# Altium project Lidar_MCU_3.PrjPcb
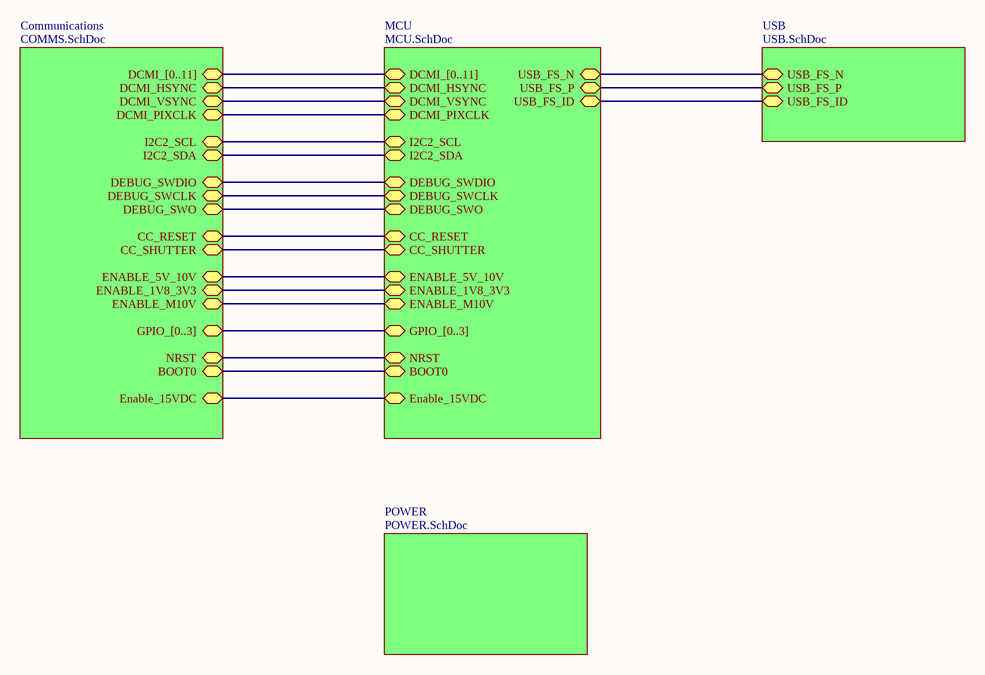
[diagram p0: Top_Level_MCU.SchDoc]
5 sheets, 41 parts. Net scope: hierarchical (ports join the sheet entries above them; power ports are global).
Board file: Lidar_MCU_PCB_3.PcbDoc
Sheets:
  Top_Level_MCU.SchDoc
    MCU = MCU.SchDoc
    USB = USB.SchDoc
    Communications = COMMS.SchDoc
    POWER = POWER.SchDoc

## Sheet Top_Level_MCU.SchDoc
size A; SheetNumber: 1; SheetTotal: 5

### Sub-sheets
Communications = COMMS.SchDoc: DCMI_[0..11] (bidir), DCMI_HSYNC (bidir), DCMI_VSYNC (bidir), DCMI_PIXCLK (bidir), I2C2_SCL (bidir), I2C2_SDA (bidir), DEBUG_SWDIO (bidir), DEBUG_SWCLK (bidir), DEBUG_SWO (bidir), CC_RESET (bidir), CC_SHUTTER (bidir), ENABLE_5V_10V (bidir), ENABLE_1V8_3V3 (bidir), ENABLE_M10V (bidir), GPIO_[0..3] (bidir), NRST (bidir), BOOT0 (bidir), Enable_15VDC (bidir)
MCU = MCU.SchDoc: USB_FS_N (bidir), USB_FS_P (bidir), USB_FS_ID (bidir), DCMI_[0..11] (bidir), DCMI_HSYNC (bidir), DCMI_VSYNC (bidir), DCMI_PIXCLK (bidir), I2C2_SCL (bidir), I2C2_SDA (bidir), DEBUG_SWDIO (bidir), DEBUG_SWCLK (bidir), DEBUG_SWO (bidir), CC_RESET (bidir), CC_SHUTTER (bidir), ENABLE_5V_10V (bidir), ENABLE_1V8_3V3 (bidir), ENABLE_M10V (bidir), GPIO_[0..3] (bidir), NRST (bidir), BOOT0 (bidir), Enable_15VDC (bidir)
POWER = POWER.SchDoc: no entries
USB = USB.SchDoc: USB_FS_N (bidir), USB_FS_P (bidir), USB_FS_ID (bidir)

### Nets
BOOT0: sheet MCU/BOOT0, sheet Communications/BOOT0
CC_RESET: sheet MCU/CC_RESET, sheet Communications/CC_RESET
CC_SHUTTER: sheet MCU/CC_SHUTTER, sheet Communications/CC_SHUTTER
DCMI_HSYNC: sheet MCU/DCMI_HSYNC, sheet Communications/DCMI_HSYNC
DCMI_PIXCLK: sheet MCU/DCMI_PIXCLK, sheet Communications/DCMI_PIXCLK
DCMI_VSYNC: sheet MCU/DCMI_VSYNC, sheet Communications/DCMI_VSYNC
DEBUG_SWCLK: sheet MCU/DEBUG_SWCLK, sheet Communications/DEBUG_SWCLK
DEBUG_SWDIO: sheet MCU/DEBUG_SWDIO, sheet Communications/DEBUG_SWDIO
DEBUG_SWO: sheet MCU/DEBUG_SWO, sheet Communications/DEBUG_SWO
ENABLE_1V8_3V3: sheet MCU/ENABLE_1V8_3V3, sheet Communications/ENABLE_1V8_3V3
ENABLE_5V_10V: sheet MCU/ENABLE_5V_10V, sheet Communications/ENABLE_5V_10V
Enable_15VDC: sheet MCU/Enable_15VDC, sheet Communications/Enable_15VDC
ENABLE_M10V: sheet MCU/ENABLE_M10V, sheet Communications/ENABLE_M10V
I2C2_SCL: sheet MCU/I2C2_SCL, sheet Communications/I2C2_SCL
I2C2_SDA: sheet MCU/I2C2_SDA, sheet Communications/I2C2_SDA
NRST: sheet MCU/NRST, sheet Communications/NRST
USB_FS_ID: sheet MCU/USB_FS_ID, sheet USB/USB_FS_ID
USB_FS_N: sheet MCU/USB_FS_N, sheet USB/USB_FS_N
USB_FS_P: sheet MCU/USB_FS_P, sheet USB/USB_FS_P

### Buses and harness runs
bus sheet Communications/DCMI_[0..11] = sheet MCU/DCMI_[0..11]
bus sheet Communications/GPIO_[0..3] = sheet MCU/GPIO_[0..3]

## Sheet MCU.SchDoc
size A3; SheetNumber: 2; SheetTotal: 5
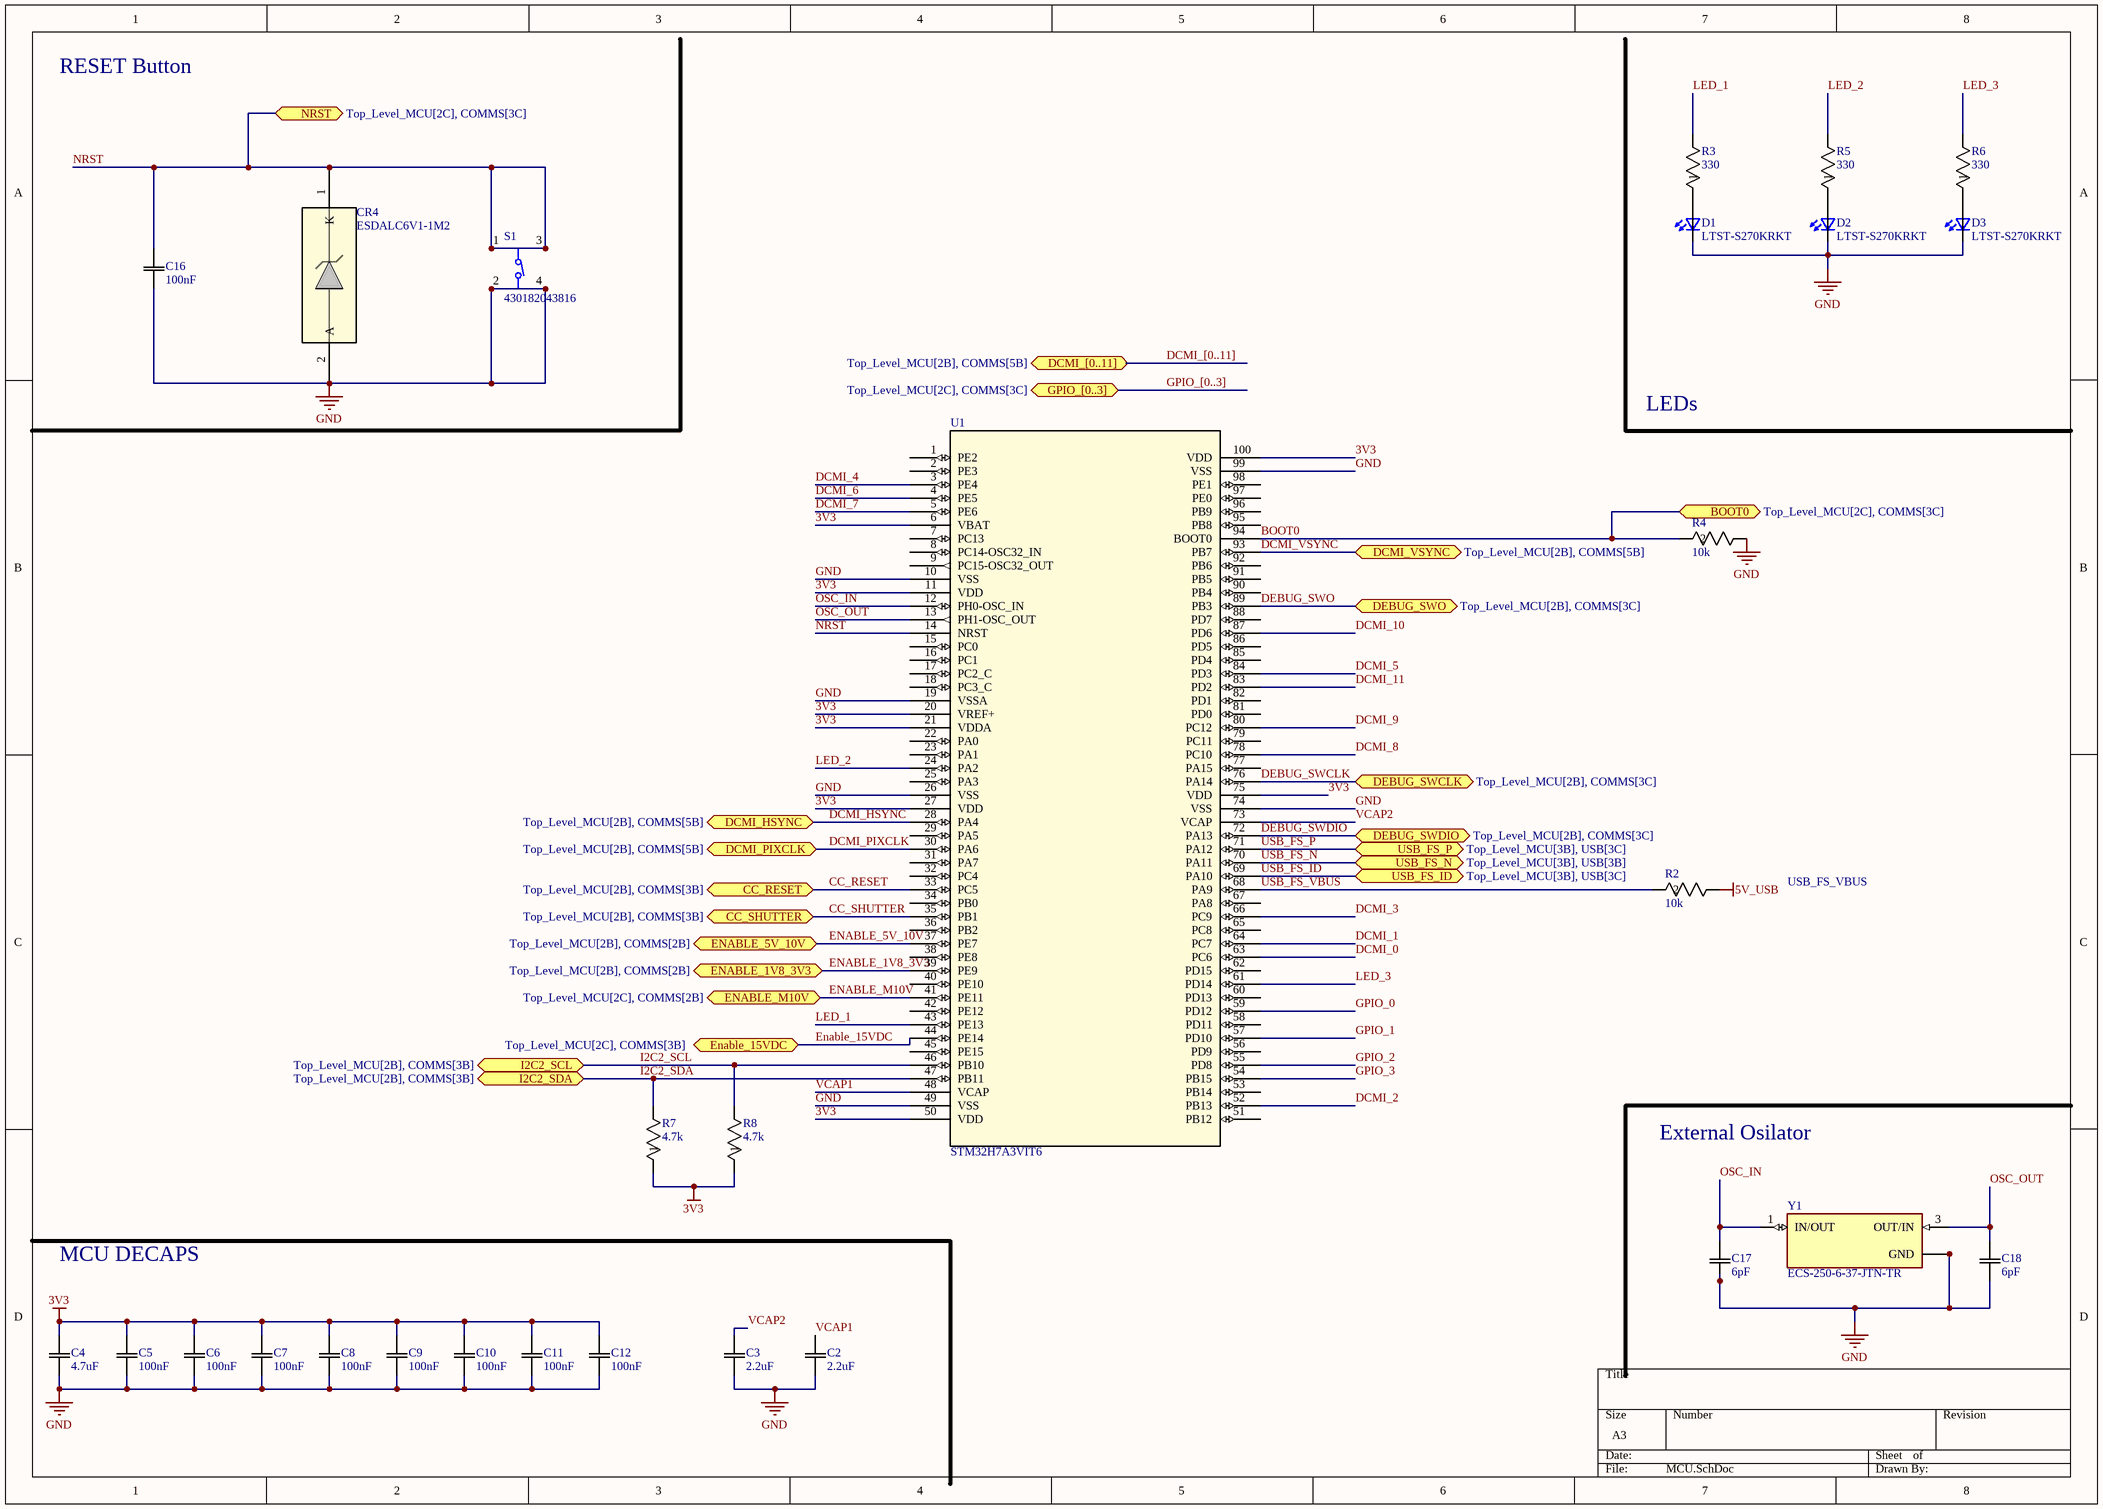
[diagram p1: MCU.SchDoc]

### Parts
C2  2.2uF  [CAP_CL10_SAM]
C3  2.2uF  [CAP_CL10_SAM]
C4  4.7uF  [LMK107_TAY]
C5  100nF  [CAPC10555_55N_KEM]
C6  100nF  [CAPC10555_55N_KEM]
C7  100nF  [CAPC10555_55N_KEM]
C8  100nF  [CAPC10555_55N_KEM]
C9  100nF  [CAPC10555_55N_KEM]
C10  100nF  [CAPC10555_55N_KEM]
C11  100nF  [CAPC10555_55N_KEM]
C12  100nF  [CAPC10555_55N_KEM]
C16  100nF  [CAPC17595_90N_KEM]
C17  6pF  [CAP_06033D104JAT2A]
C18  6pF  [CAP_06033D104JAT2A]
CR4  ESDALC6V1-1M2  [SOD882_STM]
D1  LTST-S270KRKT  [0603]
D2  LTST-S270KRKT  [0603]
D3  LTST-S270KRKT  [0603]
R2  10k  [RC0402N_YAG]
R3  330  [STA_RMCF0603_STP]
R4  10k  [RC0402N_YAG]
R5  330  [STA_RMCF0603_STP]
R6  330  [STA_RMCF0603_STP]
R7  4.7k  [YAG_R0402_YAG]
R8  4.7k  [YAG_R0402_YAG]
S1  430182043816  [430182043816]
U1  STM32H7A3VIT6  [LQFP100]
Y1  ECS-250-6-37-JTN-TR  [XTAL_ECS-250-6-37-JTN-TR]

### Ports
BOOT0 (bidir, see Top_Level_MCU[2C], COMMS[3C]), CC_RESET (bidir, see Top_Level_MCU[2B], COMMS[3B]), CC_SHUTTER (bidir, see Top_Level_MCU[2B], COMMS[3B]), DCMI_[0..11] (bidir, see Top_Level_MCU[2B], COMMS[5B]), DCMI_HSYNC (bidir, see Top_Level_MCU[2B], COMMS[5B]), DCMI_PIXCLK (bidir, see Top_Level_MCU[2B], COMMS[5B]), DCMI_VSYNC (bidir, see Top_Level_MCU[2B], COMMS[5B]), DEBUG_SWCLK (bidir, see Top_Level_MCU[2B], COMMS[3C]), DEBUG_SWDIO (bidir, see Top_Level_MCU[2B], COMMS[3C]), DEBUG_SWO (bidir, see Top_Level_MCU[2B], COMMS[3C]), ENABLE_1V8_3V3 (bidir, see Top_Level_MCU[2B], COMMS[2B]), ENABLE_5V_10V (bidir, see Top_Level_MCU[2B], COMMS[2B]), Enable_15VDC (bidir, see Top_Level_MCU[2C], COMMS[3B]), ENABLE_M10V (bidir, see Top_Level_MCU[2C], COMMS[2B]), GPIO_[0..3] (bidir, see Top_Level_MCU[2C], COMMS[3C]), I2C2_SCL (bidir, see Top_Level_MCU[2B], COMMS[3B]), I2C2_SDA (bidir, see Top_Level_MCU[2B], COMMS[3B]), NRST (bidir, see Top_Level_MCU[2C], COMMS[3C]), USB_FS_ID (bidir, see Top_Level_MCU[3B], USB[3C]), USB_FS_N (bidir, see Top_Level_MCU[3B], USB[3B]), USB_FS_P (bidir, see Top_Level_MCU[3B], USB[3C])

### Nets
3V3: C4.2 C5.2 C6.2 C7.2 C8.2 C9.2 C10.2 C11.2 C12.2 R7.1 R8.1 U1.6(VBAT) U1.11(VDD) U1.20(VREF+) U1.21(VDDA) U1.27(VDD) U1.50(VDD) U1.75(VDD) U1.100(VDD)
5V_USB: R2.1
GND: C2.1 C3.1 C4.1 C5.1 C6.1 C7.1 C8.1 C9.1 C10.1 C11.1 C12.1 C16.1 C17.1(EPAD) C18.1(EPAD) CR4.2(A) D1.1(K2) D2.1(K2) D3.1(K2) R4.1 S1.2 S1.4 U1.10(VSS) U1.19(VSSA) U1.26(VSS) U1.49(VSS) U1.74(VSS) U1.99(VSS) Y1.2(GND) Y1.4(GND)
BOOT0: R4.2 U1.94(BOOT0) ; port BOOT0
CC_RESET: U1.33(PC5) ; port CC_RESET
CC_SHUTTER: U1.35(PB1) ; port CC_SHUTTER
DCMI_0: U1.63(PC6)
DCMI_1: U1.64(PC7)
DCMI_2: U1.52(PB13)
DCMI_3: U1.66(PC9)
DCMI_4: U1.3(PE4)
DCMI_5: U1.84(PD3)
DCMI_6: U1.4(PE5)
DCMI_7: U1.5(PE6)
DCMI_8: U1.78(PC10)
DCMI_9: U1.80(PC12)
DCMI_10: U1.87(PD6)
DCMI_11: U1.83(PD2)
DCMI_HSYNC: U1.28(PA4) ; port DCMI_HSYNC
DCMI_PIXCLK: U1.30(PA6) ; port DCMI_PIXCLK
DCMI_VSYNC: U1.93(PB7) ; port DCMI_VSYNC
DEBUG_SWCLK: U1.76(PA14) ; port DEBUG_SWCLK
DEBUG_SWDIO: U1.72(PA13) ; port DEBUG_SWDIO
DEBUG_SWO: U1.89(PB3) ; port DEBUG_SWO
ENABLE_1V8_3V3: U1.39(PE9) ; port ENABLE_1V8_3V3
ENABLE_5V_10V: U1.37(PE7) ; port ENABLE_5V_10V
Enable_15VDC: U1.44(PE14) ; port Enable_15VDC
ENABLE_M10V: U1.41(PE11) ; port ENABLE_M10V
GPIO_0: U1.59(PD12)
GPIO_1: U1.57(PD10)
GPIO_2: U1.55(PD8)
GPIO_3: U1.54(PB15)
I2C2_SCL: R8.2 U1.46(PB10) ; port I2C2_SCL
I2C2_SDA: R7.2 U1.47(PB11) ; port I2C2_SDA
LED_1: R3.2 U1.43(PE13)
LED_2: R5.2 U1.24(PA2)
LED_3: R6.2 U1.61(PD14)
NRST: C16.2 CR4.1(K) S1.1 S1.3 U1.14(NRST) ; port NRST
OSC_IN: C17.2(EPAD) U1.12(PH0-OSC_IN) Y1.1(IN/OUT)
OSC_OUT: C18.2(EPAD) U1.13(PH1-OSC_OUT) Y1.3(OUT/IN)
USB_FS_ID: U1.69(PA10) ; port USB_FS_ID
USB_FS_N: U1.70(PA11) ; port USB_FS_N
USB_FS_P: U1.71(PA12) ; port USB_FS_P
USB_FS_VBUS: R2.2 U1.68(PA9)
VCAP1: C2.2 U1.48(VCAP)
VCAP2: C3.2 U1.73(VCAP)
NetD1_2: D1.2(A2) R3.1
NetD2_2: D2.2(A2) R5.1
NetD3_2: D3.2(A2) R6.1

Not connected (* = marked no-connect by the designer): U1 1(PE2) 2(PE3) 7(PC13) 8(PC14-OSC32_IN) 9(PC15-OSC32_OUT) 15(PC0) 16(PC1) 17(PC2_C) 18(PC3_C) 22(PA0) 23(PA1) 25(PA3) 29(PA5) 31(PA7) 32(PC4) 34(PB0) 36(PB2) 38(PE8) 40(PE10) 42(PE12) 45(PE15) 51(PB12) 53(PB14) 56(PD9) 58(PD11) 60(PD13) 62(PD15) 65(PC8) 67(PA8) 77(PA15) 79(PC11) 81(PD0) 82(PD1) 85(PD4) 86(PD5) 88(PD7) 90(PB4) 91(PB5) 92(PB6) 95(PB8) 96(PB9) 97(PE0) 98(PE1)

### Buses and harness runs
bus DCMI_[0..11] = port DCMI_[0..11]
bus GPIO_[0..3] = port GPIO_[0..3]

### Notes on the sheet
- RESET Button
- LEDs
- USB_FS_VBUS
- External Osilator
- MCU DECAPS

### Library data of the parts
C2 C3 = CL10B225KP8NNNC: No Description Available; Manufacturer_Name: Samsung; Copyright: Copyright (C) 2025 Ultra Librarian. All rights reserved.; Manufacturer_Part_Number: CL10B225KP8NNNC
C4 = LMK107BJ475MAHT: No Description Available; Manufacturer_Name: TAIYO YUDEN; Copyright: Copyright (C) 2025 Ultra Librarian. All rights reserved.; Manufacturer_Part_Number: LMK107BJ475MAHT
C5-C12 = C0402C104K4RACTU: SMD Comm X7R, Ceramic, 0.1 uF, 10%, 16 VDC, X7R, SMD, MLCC, Temperature Stable, Class II, 0402; Manufacturer_Name: Kemet; Copyright: Copyright (C) 2025 Ultra Librarian. All rights reserved.; Manufacturer_Part_Number: C0402C104K4RACTU
C16 = C0603C104K9PACTU: SMD Comm X5R, Ceramic, 0.1 uF, 10%, 6.3 VDC, X5R, SMD, MLCC, Temperature Stable, Class II, 0603; Manufacturer_Name: Kemet; Copyright: Copyright (C) 2025 Ultra Librarian. All rights reserved.; Manufacturer_Part_Number: C0603C104K9PACTU
C17 C18 = 06035A6R0JAT2A: No Description Available; Manufacturer_Name: KYOCERA AVX; Copyright: Copyright (C) 2025 Ultra Librarian. All rights reserved.; Manufacturer_Part_Number: 06035A6R0JAT2A
CR4 = ESDALC6V1-1M2: Single line low capacitance Transil&#8482;, transient surge voltage suppressor (TVS) for ESD protection; Manufacturer_Name: STMicroelectronics; Copyright: Copyright (C) 2025 Ultra Librarian. All rights reserved.; Manufacturer_Part_Number: ESDALC6V1-1M2; RefDes: RefDes; Type: Type
D1-D3 = LTST-S270KRKT: http://octopart.com/ltst-c190tbkt-lite-on-550003; MF: {'manufacturer': u'Lite-On Inc.'}; Package: None; Price: None; Value: *; MP: LTST-S270KRKT; Availability: Unavailable
R2 R4 = RC0402FR-0710KL: RES; SMT (0402); 10K; 1%; +/-100PPM/DEGC; 0.0630W; Manufacturer_Name: Yageo; Copyright: Copyright (C) 2025 Ultra Librarian. All rights reserved.; Manufacturer_Part_Number: RC0402FR-0710KL
R3 R5 R6 = RMCF0603FT330R: No Description Available; Manufacturer_Name: Stackpole International; Copyright: Copyright (C) 2025 Ultra Librarian. All rights reserved.; Manufacturer_Part_Number: RMCF0603FT330R
R7 R8 = RC0402FR-074K7L: Description; Manufacturer_Name: Yageo; Copyright: Copyright (C) 2025 Ultra Librarian. All rights reserved.; Manufacturer_Part_Number: RC0402FR-074K7L
S1 = 430182043816: 6*6mm vertical type, SMT, height 4.3mm, black actuator, 160gf, T&R; MF: Wurth Electronics; SnapEDA_Link: https://www.snapeda.com/parts/430182043816/Wurth+Electronics/view-part/?ref=snap; Package: None; Value: *; MP: 430182043816; Check_prices: https://www.snapeda.com/parts/430182043816/Wurth+Electronics/view-part/?ref=eda
U1 = STM32H7A3VIT6: High-performance and DSP with DP-FPU, Arm Cortex-M7  MCU with 2MBytes of Flash memory, 1376 KB SRAM, 280 MHz CPU, L1 cache, graphic accelerations, external memory interfaces, SMPS and large set of peripherals; Manufacturer_Name: STMicroelectronics; Copyright: Copyright (C) 2025 Ultra Librarian. All rights reserved.; Manufacturer_Part_Number: STM32H7A3VIT6; RefDes: RefDes; Type: Type
Y1 = ECS-250-6-37-JTN-TR: SMD Crystal 2.0 x 1.6 x 0.45 mm ceramic package; Package: None; Price: None; Value: *; MP: ECS-250-6-37-JTN-TR; Availability: Unavailable; ComponentLink1Description: New link; ComponentLink1URL: *

## Sheet USB.SchDoc
size A3; SheetNumber: 3; SheetTotal: 5
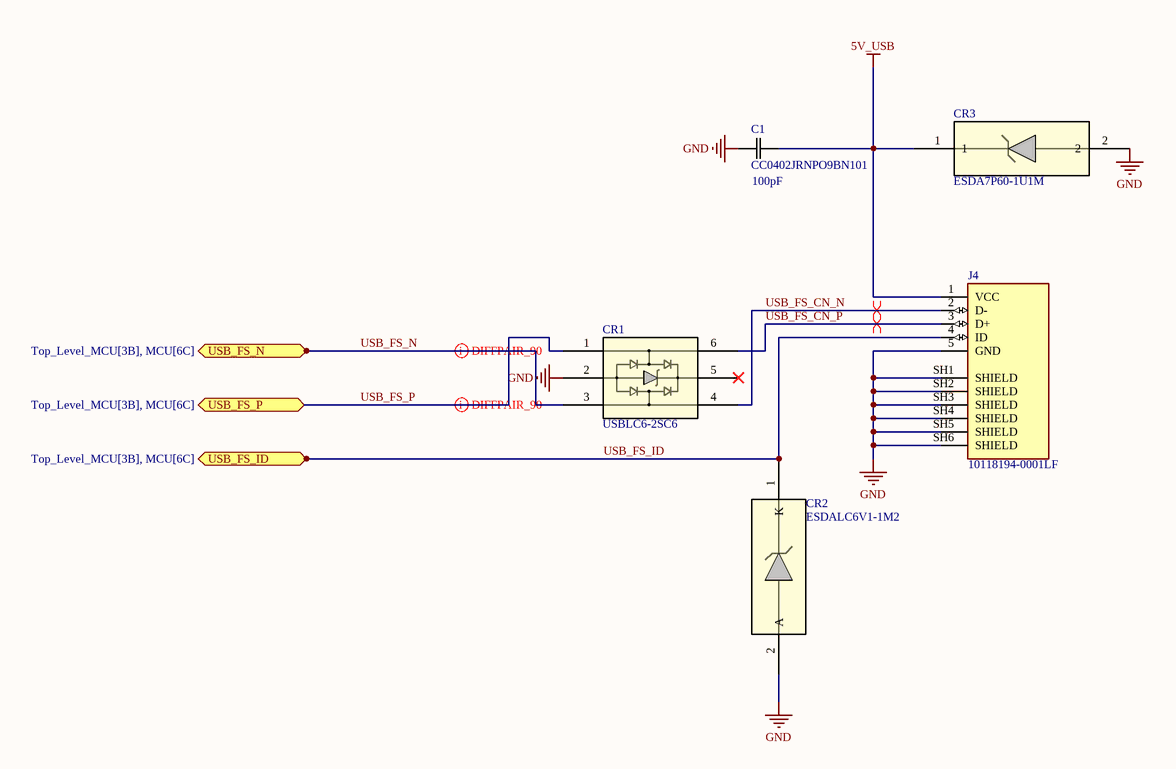
[diagram p2: USB.SchDoc]

### Parts
C1  CC0402JRNPO9BN101  [CAP_CC0402_YAG]
CR1  USBLC6-2SC6  [SOT23-6L_STM]
CR2  ESDALC6V1-1M2  [SOD882_STM]
CR3  ESDA7P60-1U1M  [ZDO_1610_STM]
J4  10118194-0001LF  [AMPHENOL_10118194-0001LF]

### Ports
USB_FS_ID (bidir, see Top_Level_MCU[3B], MCU[6C]), USB_FS_N (bidir, see Top_Level_MCU[3B], MCU[6C]), USB_FS_P (bidir, see Top_Level_MCU[3B], MCU[6C])

### Nets
5V_USB: C1.2 CR3.1 J4.1(VCC)
GND: C1.1 CR1.2 CR2.2(A) CR3.2 J4.5(GND) J4.SH1(SHIELD) J4.SH2(SHIELD) J4.SH3(SHIELD) J4.SH4(SHIELD) J4.SH5(SHIELD) J4.SH6(SHIELD)
USB_FS_CN_N: CR1.4 J4.2(D-)
USB_FS_CN_P: CR1.6 J4.3(D+)
USB_FS_ID: CR2.1(K) J4.4(ID) ; port USB_FS_ID
USB_FS_N: CR1.3 ; port USB_FS_N
USB_FS_P: CR1.1 ; port USB_FS_P

Not connected (* = marked no-connect by the designer): CR1 5*

### Layout directives
differential pair: USB_FS_CN_N, USB_FS_CN_P, USB_FS_N, USB_FS_P

### Notes on the sheet
- (near C1) 100pF

### Library data of the parts
C1 = CC0402JRNPO9BN101: CAPACITOR; SMT (0402); CERAMIC CHIP; 100PF; 50V; TOL=5%; TG=-55 DEGC TO +125 DEGC; TC=C0G; Manufacturer_Name: Yageo; Copyright: Copyright (C) 2025 Ultra Librarian. All rights reserved.; Manufacturer_Part_Number: CC0402JRNPO9BN101
CR1 = USBLC6-2SC6: ESD Protection for USB 2.0 High Speed; Manufacturer_Name: STMicroelectronics; Copyright: Copyright (C) 2025 Ultra Librarian. All rights reserved.; Manufacturer_Part_Number: USBLC6-2SC6; RefDes: RefDes; Type: Type
CR2 = ESDALC6V1-1M2: as CR4 on sheet MCU; Copyright: Copyright (C) 2025 Ultra Librarian. All rights reserved.; Manufacturer_Part_Number: ESDALC6V1-1M2; RefDes: RefDes; Type: Type
CR3 = ESDA7P60-1U1M: 60 A - 8/20 us, 5 V TVS in QFN-2L; Manufacturer_Name: STMicroelectronics; Copyright: Copyright (C) 2025 Ultra Librarian. All rights reserved.; Manufacturer_Part_Number: ESDA7P60-1U1M; RefDes: RefDes; Type: Type
J4 = 10118194-0001LF: Micro USB, Input Output Connectors, B TYPE RECEPTACLE with flange; MF: Amphenol ICC; SnapEDA_Link: https://www.snapeda.com/parts/10118194-0001LF/Amphenol+FCI/view-part/?ref=snap; Package: None; Value: *; MP: 10118194-0001LF; Check_prices: https://www.snapeda.com/parts/10118194-0001LF/Amphenol+FCI/view-part/?ref=eda

## Sheet COMMS.SchDoc
size A3; SheetNumber: 4; SheetTotal: 5
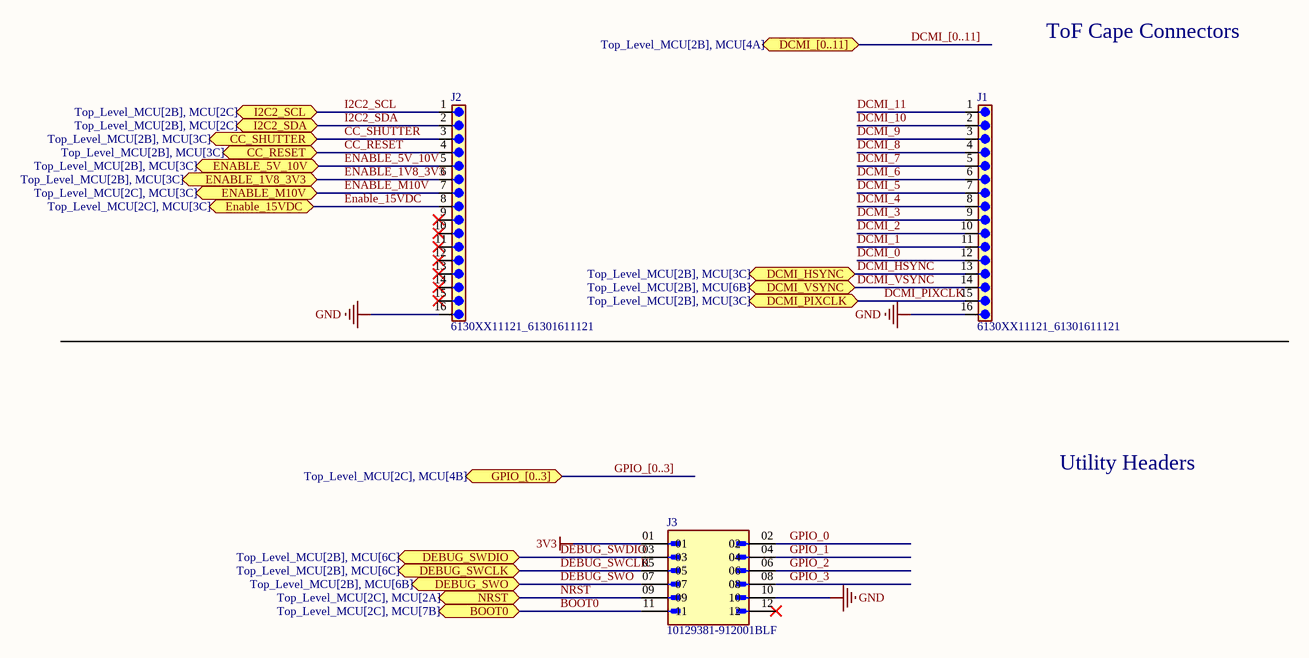
[diagram p3: COMMS.SchDoc]

### Parts
J1  6130XX11121_61301611121  [61301611121]
J2  6130XX11121_61301611121  [61301611121]
J3  10129381-912001BLF  [AMPHENOL_10129381-912001BLF]

### Ports
BOOT0 (bidir, see Top_Level_MCU[2C], MCU[7B]), CC_RESET (bidir, see Top_Level_MCU[2B], MCU[3C]), CC_SHUTTER (bidir, see Top_Level_MCU[2B], MCU[3C]), DCMI_[0..11] (bidir, see Top_Level_MCU[2B], MCU[4A]), DCMI_HSYNC (bidir, see Top_Level_MCU[2B], MCU[3C]), DCMI_PIXCLK (bidir, see Top_Level_MCU[2B], MCU[3C]), DCMI_VSYNC (bidir, see Top_Level_MCU[2B], MCU[6B]), DEBUG_SWCLK (bidir, see Top_Level_MCU[2B], MCU[6C]), DEBUG_SWDIO (bidir, see Top_Level_MCU[2B], MCU[6C]), DEBUG_SWO (bidir, see Top_Level_MCU[2B], MCU[6B]), ENABLE_1V8_3V3 (bidir, see Top_Level_MCU[2B], MCU[3C]), ENABLE_5V_10V (bidir, see Top_Level_MCU[2B], MCU[3C]), Enable_15VDC (bidir, see Top_Level_MCU[2C], MCU[3C]), ENABLE_M10V (bidir, see Top_Level_MCU[2C], MCU[3C]), GPIO_[0..3] (bidir, see Top_Level_MCU[2C], MCU[4B]), I2C2_SCL (bidir, see Top_Level_MCU[2B], MCU[2C]), I2C2_SDA (bidir, see Top_Level_MCU[2B], MCU[2C]), NRST (bidir, see Top_Level_MCU[2C], MCU[2A])

### Nets
3V3: J3.01
GND: J1.16 J2.16 J3.10
BOOT0: J3.11 ; port BOOT0
CC_RESET: J2.4 ; port CC_RESET
CC_SHUTTER: J2.3 ; port CC_SHUTTER
DCMI_0: J1.12
DCMI_1: J1.11
DCMI_2: J1.10
DCMI_3: J1.9
DCMI_4: J1.8
DCMI_5: J1.7
DCMI_6: J1.6
DCMI_7: J1.5
DCMI_8: J1.4
DCMI_9: J1.3
DCMI_10: J1.2
DCMI_11: J1.1
DCMI_HSYNC: J1.13 ; port DCMI_HSYNC
DCMI_PIXCLK: J1.15 ; port DCMI_PIXCLK
DCMI_VSYNC: J1.14 ; port DCMI_VSYNC
DEBUG_SWCLK: J3.05 ; port DEBUG_SWCLK
DEBUG_SWDIO: J3.03 ; port DEBUG_SWDIO
DEBUG_SWO: J3.07 ; port DEBUG_SWO
ENABLE_1V8_3V3: J2.6 ; port ENABLE_1V8_3V3
ENABLE_5V_10V: J2.5 ; port ENABLE_5V_10V
Enable_15VDC: J2.8 ; port Enable_15VDC
ENABLE_M10V: J2.7 ; port ENABLE_M10V
GPIO_0: J3.02
GPIO_1: J3.04
GPIO_2: J3.06
GPIO_3: J3.08
I2C2_SCL: J2.1 ; port I2C2_SCL
I2C2_SDA: J2.2 ; port I2C2_SDA
NRST: J3.09 ; port NRST

Not connected (* = marked no-connect by the designer): J2 9* 10* 11* 12* 13* 14* 15*; J3 12*

### Buses and harness runs
bus DCMI_[0..11] = port DCMI_[0..11]
bus GPIO_[0..3] = port GPIO_[0..3]

### Notes on the sheet
- ToF Cape Connectors
- Utility Headers

### Library data of the parts
J1 J2 = 6130XX11121_61301611121: MF: {'manufacturer': u'Wurth Electronics'}; Package: None; Price: None; Value: *; MP: 61301611121; Availability: Unavailable
J3 = 10129381-912001BLF: EconoStikâ„¢, Board to Board connector, Unshrouded Vertical Header, Through Hole, Double Row, 12 Positions, 2.54 mm (0.100in) Pitch.; MF: Amphenol ICC (FCI); Check_prices: https://www.snapeda.com/parts/10129381-912001BLF/Amphenol+FCI/view-part/?ref=eda; SnapEDA_Link: https://www.snapeda.com/parts/10129381-912001BLF/Amphenol+FCI/view-part/?ref=snap; Value: *; Purchase-URL: https://pricing.snapeda.com/search/part/10129381-912001BLF/?ref=eda; Package: None; MP: 10129381-912001BLF; Digi-Key_Part_Number: 10129381-912001BLF-ND

## Sheet POWER.SchDoc
size A3; SheetNumber: 5; SheetTotal: 5
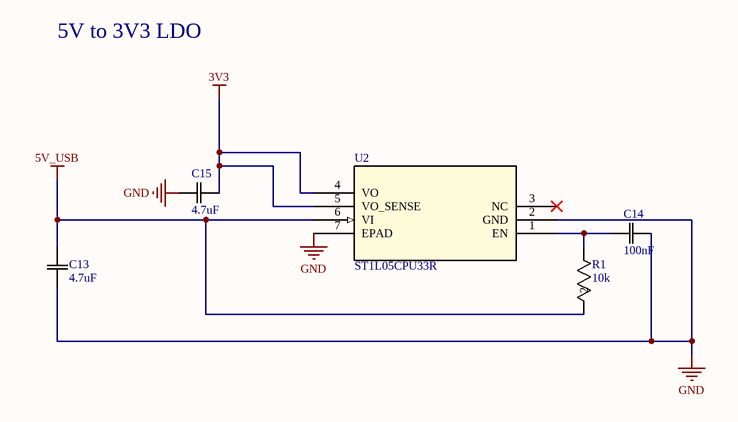
[diagram p4: POWER.SchDoc]

### Parts
C13  4.7uF  [CAP_CL10_SAM]
C14  100nF  [CAPC10555_55N_KEM]
C15  4.7uF  [LMK107_TAY]
R1  10k  [RC0402N_YAG]
U2  ST1L05CPU33R  [DFN6_3X3_STM]

### Nets
3V3: C15.2 U2.4(VO) U2.5(VO_SENSE)
5V_USB: C13.2 R1.2 U2.6(VI)
GND: C13.1 C14.1 C15.1 U2.2(GND) U2.7(EPAD)
NetC14_2: C14.2 R1.1 U2.1(EN)

Not connected (* = marked no-connect by the designer): U2 3(NC)*

### Notes on the sheet
- 5V to 3V3 LDO

### Library data of the parts
C13 = CL10A475MO8NNNC: No Description Available; Manufacturer_Name: Samsung; Copyright: Copyright (C) 2025 Ultra Librarian. All rights reserved.; Manufacturer_Part_Number: CL10A475MO8NNNC
C14 = C0402C104K4RACTU: as C5 on sheet MCU; Copyright: Copyright (C) 2025 Ultra Librarian. All rights reserved.; Manufacturer_Part_Number: C0402C104K4RACTU
C15 = LMK107BJ475MAHT: as C4 on sheet MCU; Copyright: Copyright (C) 2025 Ultra Librarian. All rights reserved.; Manufacturer_Part_Number: LMK107BJ475MAHT
R1 = RC0402FR-0710KL: as R2 on sheet MCU; Copyright: Copyright (C) 2025 Ultra Librarian. All rights reserved.; Manufacturer_Part_Number: RC0402FR-0710KL
U2 = ST1L05CPU33R: Very low quiescent BiCMOS voltage regulator; Manufacturer_Name: STMicroelectronics; Copyright: Copyright (C) 2025 Ultra Librarian. All rights reserved.; Manufacturer_Part_Number: ST1L05CPU33R; RefDes: RefDes; Type: Type

## Nets that join several sheets
3V3: MCU (19 pins), COMMS (J3.01), POWER (C15.2 U2.4 U2.5)
5V_USB: MCU (R2.1), USB (C1.2 CR3.1 J4.1), POWER (C13.2 R1.2 U2.6)
GND: MCU (29 pins), USB (11 pins), COMMS (J1.16 J2.16 J3.10), POWER (5 pins)
BOOT0: MCU (R4.2 U1.94), COMMS (J3.11)
CC_RESET: MCU (U1.33), COMMS (J2.4)
CC_SHUTTER: MCU (U1.35), COMMS (J2.3)
DCMI_0: MCU (U1.63), COMMS (J1.12)
DCMI_1: MCU (U1.64), COMMS (J1.11)
DCMI_2: MCU (U1.52), COMMS (J1.10)
DCMI_3: MCU (U1.66), COMMS (J1.9)
DCMI_4: MCU (U1.3), COMMS (J1.8)
DCMI_5: MCU (U1.84), COMMS (J1.7)
DCMI_6: MCU (U1.4), COMMS (J1.6)
DCMI_7: MCU (U1.5), COMMS (J1.5)
DCMI_8: MCU (U1.78), COMMS (J1.4)
DCMI_9: MCU (U1.80), COMMS (J1.3)
DCMI_10: MCU (U1.87), COMMS (J1.2)
DCMI_11: MCU (U1.83), COMMS (J1.1)
DCMI_HSYNC: MCU (U1.28), COMMS (J1.13)
DCMI_PIXCLK: MCU (U1.30), COMMS (J1.15)
DCMI_VSYNC: MCU (U1.93), COMMS (J1.14)
DEBUG_SWCLK: MCU (U1.76), COMMS (J3.05)
DEBUG_SWDIO: MCU (U1.72), COMMS (J3.03)
DEBUG_SWO: MCU (U1.89), COMMS (J3.07)
ENABLE_1V8_3V3: MCU (U1.39), COMMS (J2.6)
ENABLE_5V_10V: MCU (U1.37), COMMS (J2.5)
Enable_15VDC: MCU (U1.44), COMMS (J2.8)
ENABLE_M10V: MCU (U1.41), COMMS (J2.7)
GPIO_0: MCU (U1.59), COMMS (J3.02)
GPIO_1: MCU (U1.57), COMMS (J3.04)
GPIO_2: MCU (U1.55), COMMS (J3.06)
GPIO_3: MCU (U1.54), COMMS (J3.08)
I2C2_SCL: MCU (R8.2 U1.46), COMMS (J2.1)
I2C2_SDA: MCU (R7.2 U1.47), COMMS (J2.2)
NRST: MCU (5 pins), COMMS (J3.09)
USB_FS_ID: MCU (U1.69), USB (CR2.1 J4.4)
USB_FS_N: MCU (U1.70), USB (CR1.3)
USB_FS_P: MCU (U1.71), USB (CR1.1)